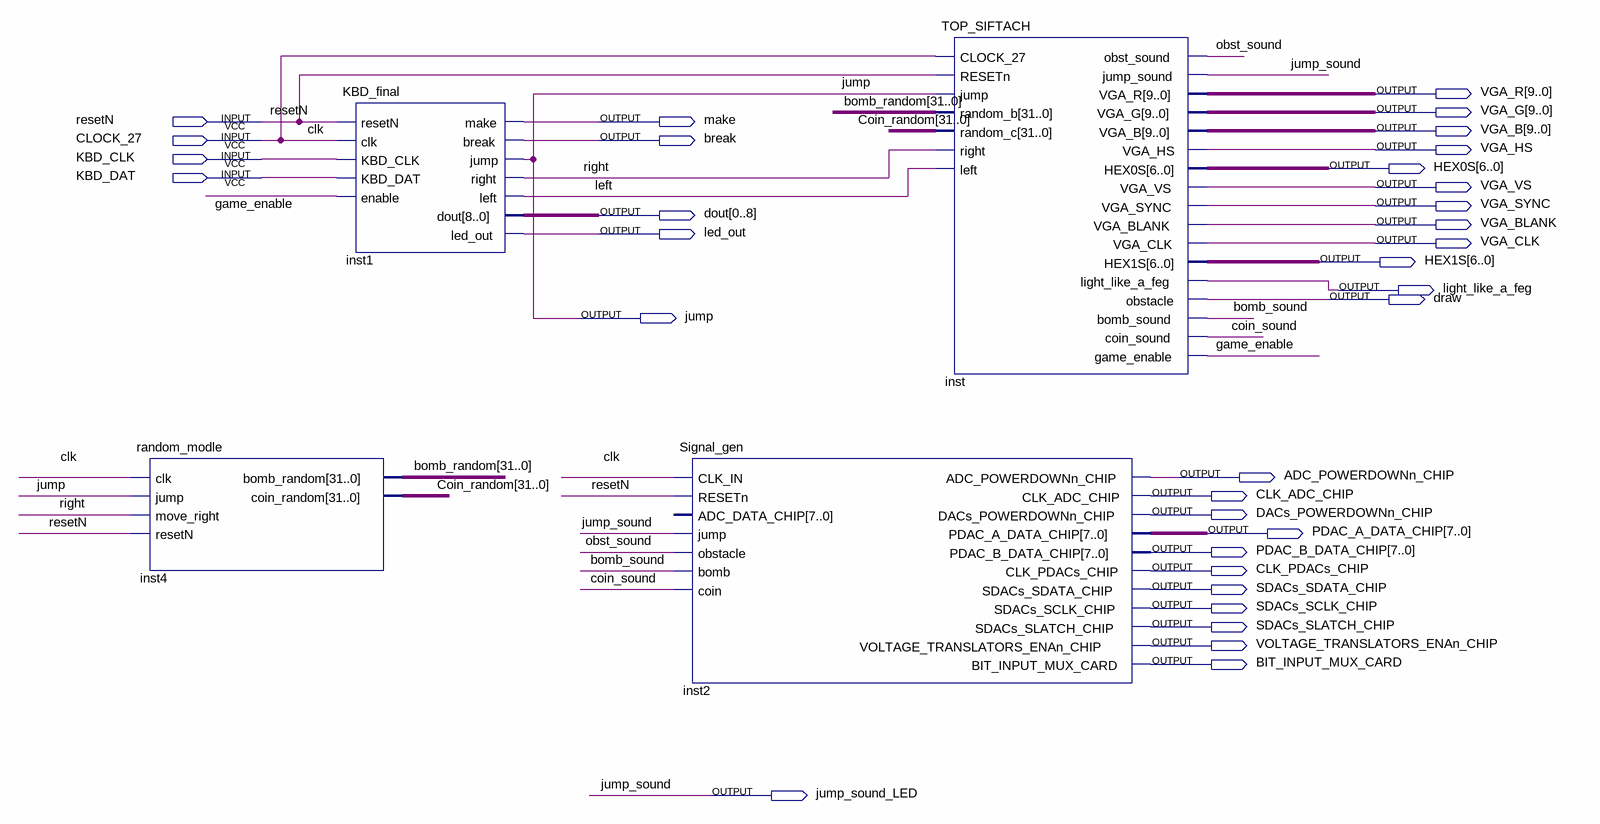
[diagram p0: schematic sheet]
// Quartus schematic super_mario.bdf as structural Verilog: 4 symbols, 33 pins
module super_mario (
  input  resetN,
  input  CLOCK_27,
  input  KBD_CLK,
  input  KBD_DAT,
  output [9:0] VGA_R,
  output [9:0] VGA_G,
  output make,
  output [9:0] VGA_B,
  output \break ,
  output VGA_HS,
  output [6:0] HEX0S,
  output VGA_VS,
  output VGA_SYNC,
  output [0:8] dout,
  output VGA_BLANK,
  output led_out,
  output VGA_CLK,
  output [6:0] HEX1S,
  output light_like_a_feg,
  output draw,
  output jump,
  output ADC_POWERDOWNn_CHIP,
  output CLK_ADC_CHIP,
  output DACs_POWERDOWNn_CHIP,
  output [7:0] PDAC_A_DATA_CHIP,
  output [7:0] PDAC_B_DATA_CHIP,
  output CLK_PDACs_CHIP,
  output SDACs_SDATA_CHIP,
  output SDACs_SCLK_CHIP,
  output SDACs_SLATCH_CHIP,
  output VOLTAGE_TRANSLATORS_ENAn_CHIP,
  output BIT_INPUT_MUX_CARD,
  output jump_sound_LED
);

  wire bomb_sound, coin_sound, game_enable, left, obst_sound, right;
  wire [31:0] bomb_random, Coin_random;

  random_modle inst4 (
    .clk(CLOCK_27), .jump(jump), .move_right(right), .resetN(resetN), .bomb_random(bomb_random),
    .coin_random(Coin_random));
  KBD_final inst1 (
    .resetN(resetN), .clk(CLOCK_27), .KBD_CLK(KBD_CLK), .KBD_DAT(KBD_DAT), .enable(game_enable), .make(make),
    .\break (\break ), .jump(jump), .right(right), .left(left), .dout(dout), .led_out(led_out));
  Signal_gen inst2 (
    .CLK_IN(CLOCK_27), .RESETn(resetN), .jump(jump_sound_LED), .obstacle(obst_sound), .bomb(bomb_sound),
    .coin(coin_sound), .ADC_POWERDOWNn_CHIP(ADC_POWERDOWNn_CHIP), .CLK_ADC_CHIP(CLK_ADC_CHIP),
    .DACs_POWERDOWNn_CHIP(DACs_POWERDOWNn_CHIP), .PDAC_A_DATA_CHIP(PDAC_A_DATA_CHIP),
    .PDAC_B_DATA_CHIP(PDAC_B_DATA_CHIP), .CLK_PDACs_CHIP(CLK_PDACs_CHIP),
    .SDACs_SDATA_CHIP(SDACs_SDATA_CHIP), .SDACs_SCLK_CHIP(SDACs_SCLK_CHIP),
    .SDACs_SLATCH_CHIP(SDACs_SLATCH_CHIP), .VOLTAGE_TRANSLATORS_ENAn_CHIP(VOLTAGE_TRANSLATORS_ENAn_CHIP),
    .BIT_INPUT_MUX_CARD(BIT_INPUT_MUX_CARD));  // open: ADC_DATA_CHIP
  TOP_SIFTACH inst (
    .CLOCK_27(CLOCK_27), .RESETn(resetN), .jump(jump), .random_b(bomb_random), .random_c(Coin_random),
    .right(right), .left(left), .obst_sound(obst_sound), .jump_sound(jump_sound_LED), .VGA_R(VGA_R),
    .VGA_G(VGA_G), .VGA_B(VGA_B), .VGA_HS(VGA_HS), .HEX0S(HEX0S), .VGA_VS(VGA_VS), .VGA_SYNC(VGA_SYNC),
    .VGA_BLANK(VGA_BLANK), .VGA_CLK(VGA_CLK), .HEX1S(HEX1S), .light_like_a_feg(light_like_a_feg),
    .obstacle(draw), .bomb_sound(bomb_sound), .coin_sound(coin_sound), .game_enable(game_enable));

  // Other names for the same wires on the sheet: clk = CLOCK_27; jump_sound = jump_sound_LED
endmodule
